# EAGLE design StoryBoxShield_v1 (EAGLE 5.11)
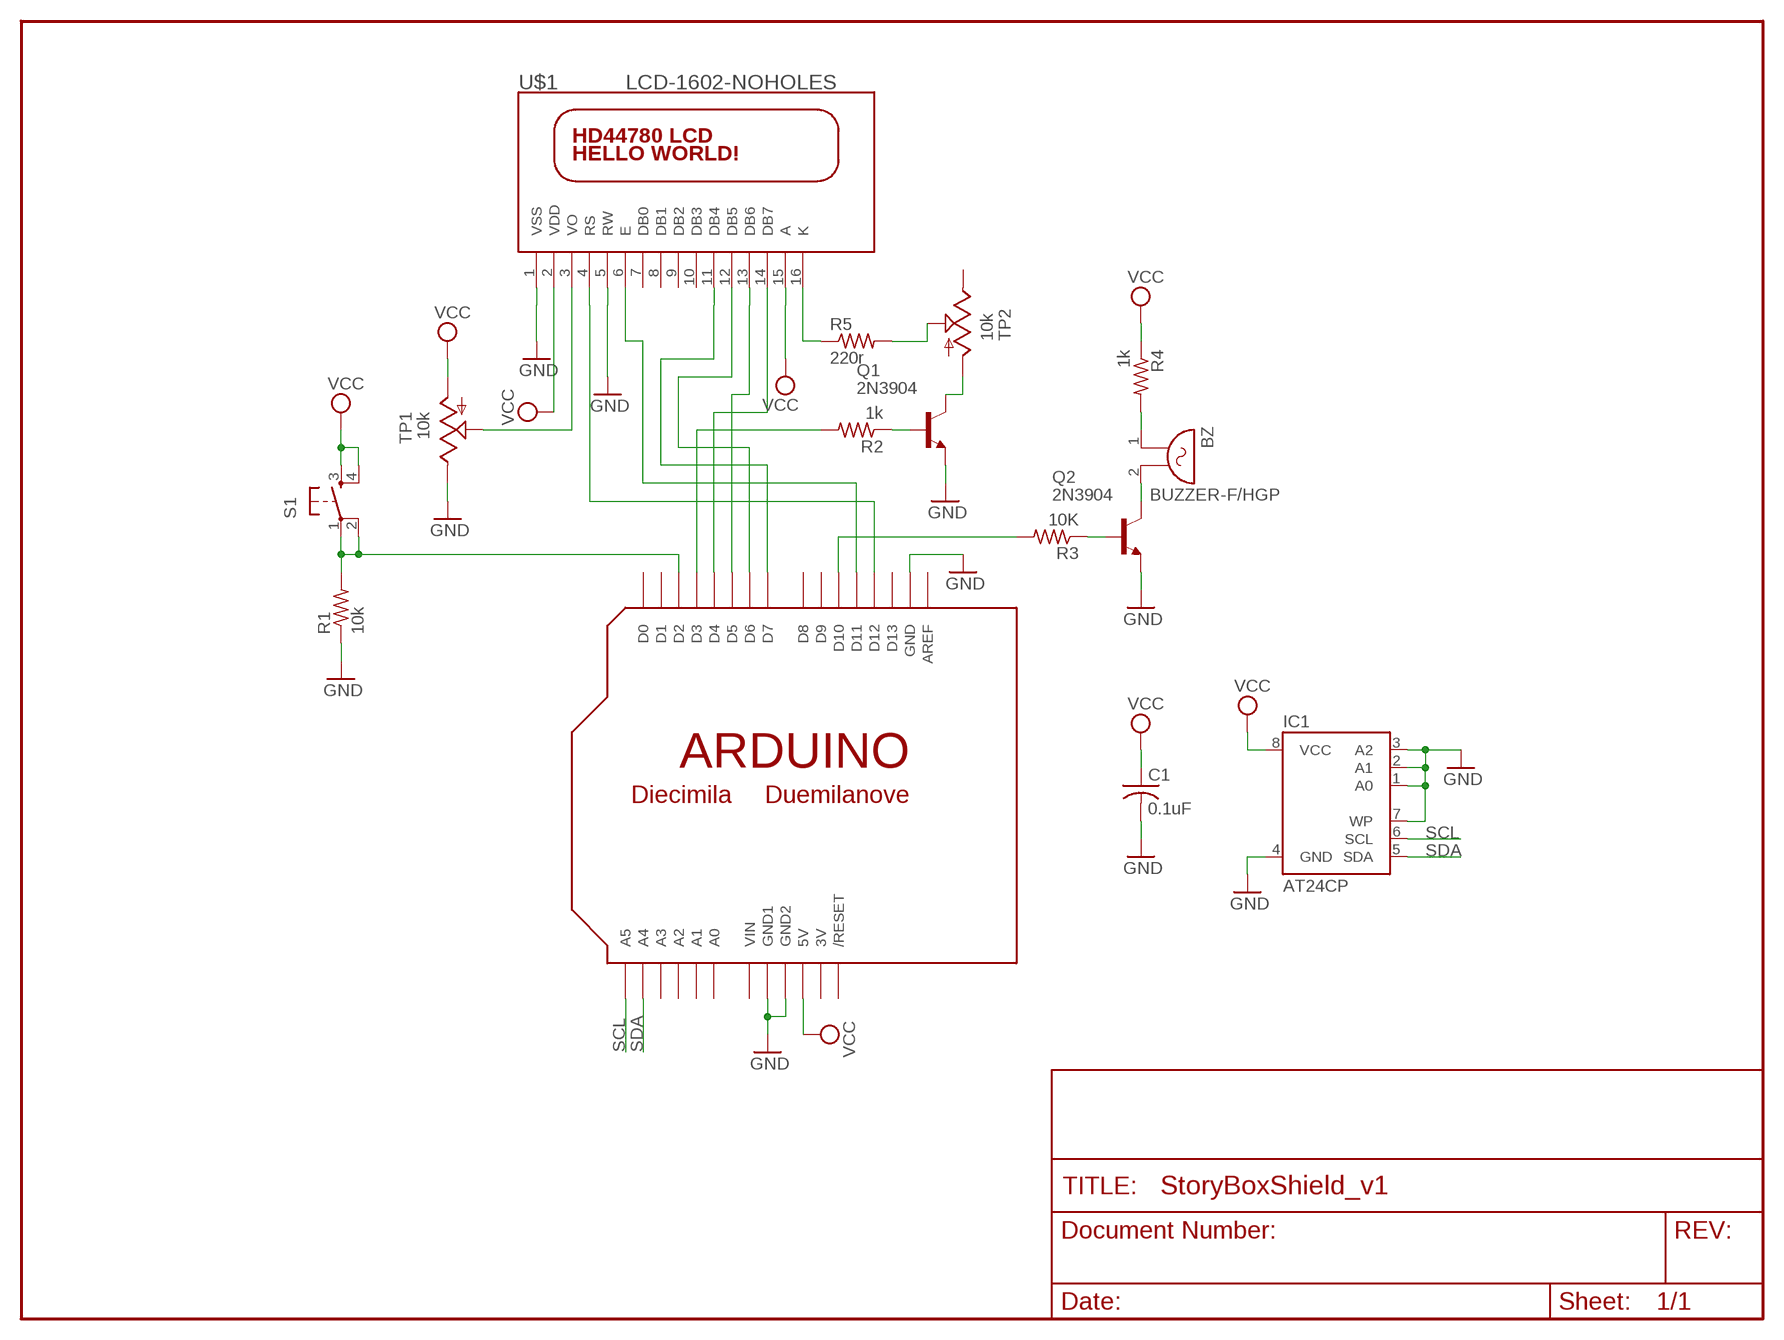
[diagram p0: schematic, sheet 1]

## Parts
BZ  BUZZER-F/HGP  [F/HGP]
C1  0.1uF  CAP-C050-025X075  [C050-025X075]
IC1  AT24CP  [DIL08]
Q1  2N3904  NPN-CBE-ZZ  [TO92-ZZ]
Q2  2N3904  NPN-CBE-ZZ  [TO92-ZZ]
R1  10k  RES0207/10-H  [0207/10-H]
R2  1k  RES0207/10-H  [0207/10-H]
R3  10K  RES0207/10-H  [0207/10-H]
R4  1k  RES0207/10-H  [0207/10-H]
R5  220r  RES0207/10-H  [0207/10-H]
S1  TAC_SWITCHPTH  [TACTILE-PTH]
TP1  10k  POT-TPOT-CB10V  [CB10V]
TP2  10k  POT-TPOT-CB10V  [CB10V]
U$1  LCD-1602-NOHOLES  [LCD1602-NOHOLES]
U$3  ARDUINO-DM-NOHOLE  [DM-NOHOLE]

## Nets
GND: C1.2 IC1.1(A0) IC1.2(A1) IC1.3(A2) IC1.4(GND) IC1.7(WP) Q1.3(E) Q2.3(E) R1.1 TP1.E2(E) U$1.1(VSS) U$1.5(RW) U$3.GND U$3.GND1 U$3.GND2
N$1: Q1.1(C) TP2.E1(A)
N$2: R5.1 U$1.16(K)
N$3: U$1.14(DB7) U$3.D4
N$4: U$1.13(DB6) U$3.D5
N$5: U$1.12(DB5) U$3.D6
N$6: U$1.11(DB4) U$3.D7
N$7: U$1.6(E) U$3.D11
N$8: U$1.4(RS) U$3.D12
N$9: TP1.V(S) U$1.3(VO)
N$10: R2.2 U$3.D3
N$11: R1.2 S1.1 S1.2 U$3.D2
N$12: R3.2 U$3.D10
N$13: BZ.2 Q2.1(C)
N$14: Q2.2(B) R3.1
N$17: BZ.1 R4.2
N$18: Q1.2(B) R2.1
N$19: R5.2 TP2.V(S)
SCL: IC1.6(SCL) U$3.A5
SDA: IC1.5(SDA) U$3.A4
VCC: C1.1 IC1.8(VCC) R4.1 S1.3 S1.4 TP1.E1(A) U$1.2(VDD) U$1.15(A) U$3.5V
Unconnected: TP2.E2(E) U$1.7(DB0) U$1.8(DB1) U$1.9(DB2) U$1.10(DB3) U$3.A0 U$3.A1 U$3.A2 U$3.A3 U$3.AREF U$3.D0 U$3.D1 U$3.D8 U$3.D9 U$3.D13 U$3.RESET(/RESET)

## Power pins joined to a net without a drawn wire
3V: U$3.3V
VIN: U$3.VIN

## Library data of the parts
BZ = fatpads:BUZZER
C1 = fatpads:CAP
IC1 = atmel:AT24C*: 2-wire serial EEPROM; MPN: AT24C1024BW-SH-B; OC_FARNELL: 1362646; OC_NEWARK: 03P2044
Q1 Q2 = fatpads:NPN
R1-R5 = fatpads:RES
S1 = SparkFun:TAC_SWITCH: Momentary Switch Button commonly used for reset or general input. Spark Fun Electronics SKU : COM-00097
TP1 TP2 = fatpads:POT
U$1 = fatpads:LCD
U$3 = fatpads:ARDUINO

## Net classes
0 default: width 1.27 mm, clearance 1.27 mm

## Board
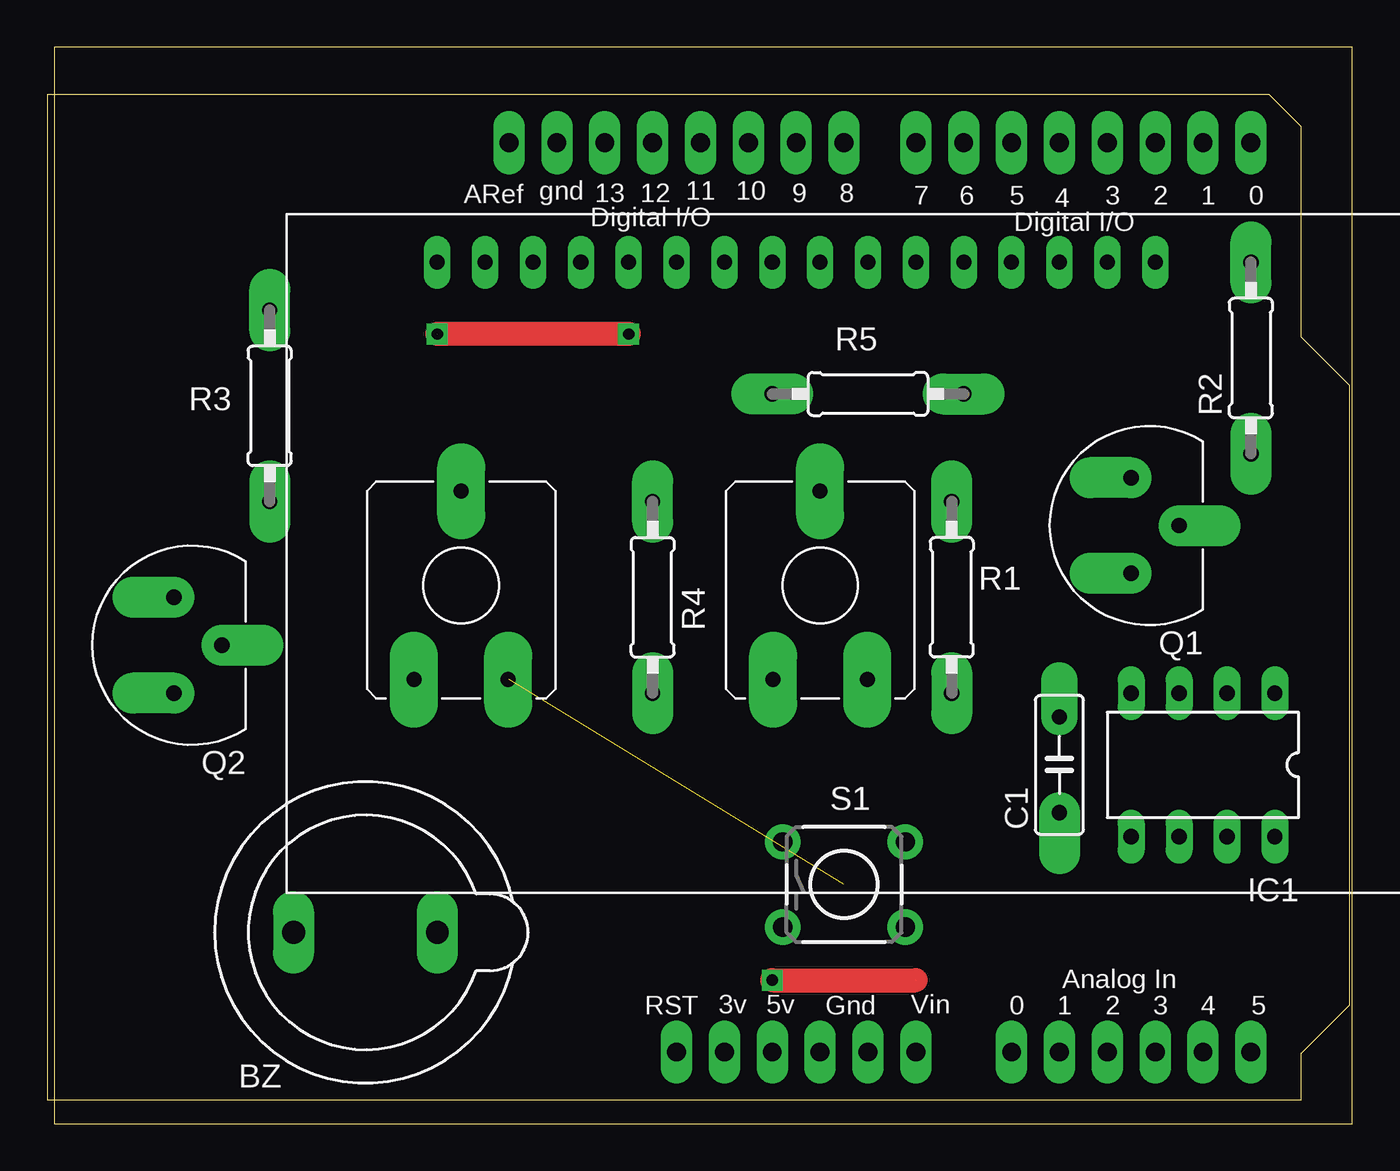
[diagram p1: board, top side]
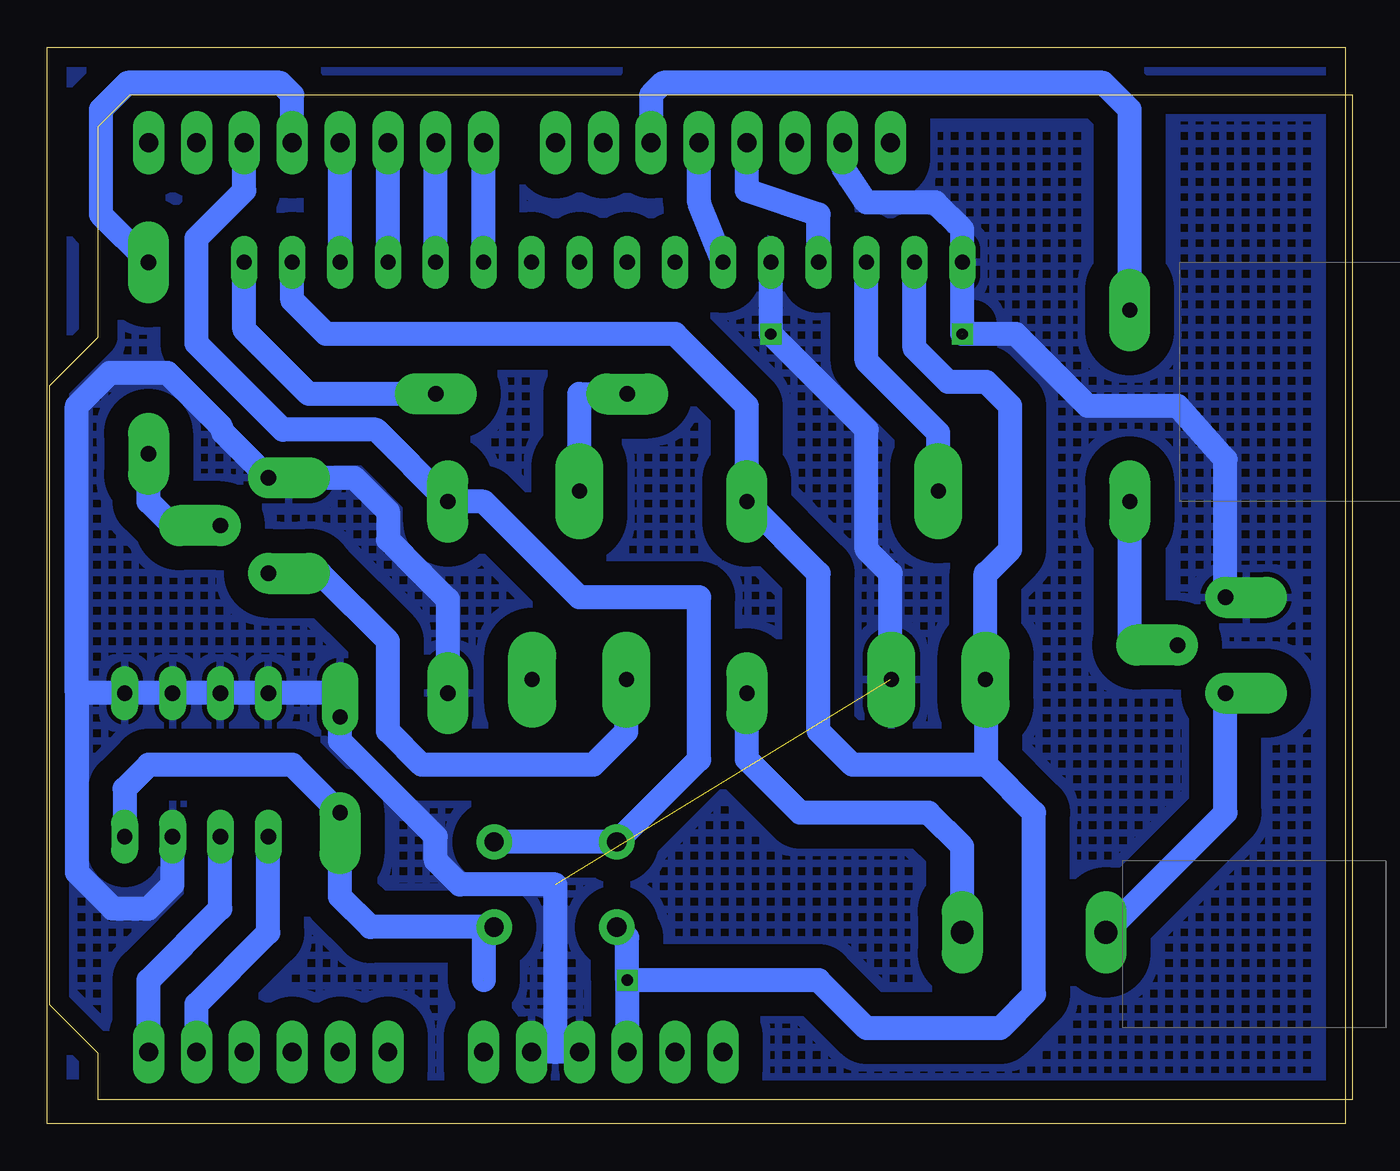
[diagram p2: board, bottom side, seen from below]

Size 68.89 x 57.14 mm. Coordinates in mm from the lower left corner, seen from the top.
Outline: 0,0 68.89,0 68.89,57.14 0,57.14 0,0
Copper layers (1*16): Top 0.035mm / dielectric 1.5mm / Bottom 0.035mm
Design rules "SparkFun *": minimum track width 50mil, minimum drill 20mil, track to track 8mil, track to pad 8mil, pad to pad 8mil, via to via 8mil, smd to smd 8mil, copper to edge 10mil, drill to drill 8mil, minimum pad ring 12mil, minimum via ring 10mil, stop-mask expansion 4mil, vias tented up to drill 25mil, thermal gap 10mil

### Footprints (pad centres in the part's own frame; a part is rotated, then mirrored left to right if it is on the bottom)
F/HGP = drill 1.2 pad 2.184 long: 1 -3.81,0; 2 3.81,0
C050-025X075 = drill 0.813 pad 2.184 offset: 1 -2.54,0 | drill 0.813 pad 1.93 offset: 2 2.54,0
DIL08 = drill 0.813 long: 1 -3.81,-3.81; 2 -1.27,-3.81; 3 1.27,-3.81; 4 3.81,-3.81; 5 3.81,3.81; 6 1.27,3.81; 7 -1.27,3.81; 8 -3.81,3.81
TO92-ZZ = drill 0.813 pad 2.184 offset: 1 -2.54,1.27; 2 0,-1.27; 3 2.54,1.27
0207/10-H = drill 0.813 pad 2.184 long: 1 -5.08,0; 2 5.08,0
TACTILE-PTH = drill 1.016 pad 1.88 round: 1 -3.251,2.261; 2 3.251,2.261; 3 -3.251,-2.261; 4 3.251,-2.261
CB10V = drill 0.8 pad 2.54 long: E1 -2.5,-5; E2 2.5,-5; V 0,5
LCD1602-NOHOLES = drill 0.8 long: 1 0,0; 2 2.54,0; 3 5.08,0; 4 7.62,0; 5 10.16,0; 6 12.7,0; 7 15.24,0; 8 17.78,0; 9 20.32,0; 10 22.86,0; 11 25.4,0; 12 27.94,0; 13 30.48,0; 14 33.02,0; 15 35.56,0; 16 38.1,0
DM-NOHOLE = drill 1 pad 1.676 long: 3V -27.94,-48.26; 5V -25.4,-48.26; A0 -12.7,-48.26; A1 -10.16,-48.26; A2 -7.62,-48.26; A3 -5.08,-48.26; A4 -2.54,-48.26; A5 0,-48.26; AREF -39.37,0; D0 0,0; D1 -2.54,0; D2 -5.08,0; D3 -7.62,0; D4 -10.16,0; D5 -12.7,0; D6 -15.24,0; D7 -17.78,0; D8 -21.59,0; D9 -24.13,0; D10 -26.67,0; D11 -29.21,0; D12 -31.75,0; D13 -34.29,0; GND -36.83,0; GND1 -20.32,-48.26; GND2 -22.86,-48.26; RESET -30.48,-48.26; VIN -17.78,-48.26

### Placement (x,y rotation side)
BZ  16.51,10.16 180 top
C1  53.34,19.05 90 top
IC1  60.96,19.05 180 top
Q1  58.42,31.75 90 top
Q2  7.62,25.4 90 top
R1  47.62,27.94 90 top
R2  63.5,40.64 90 top
R3  11.43,38.1 90 top
R4  31.75,27.94 270 top
R5  43.18,38.73 180 top
S1  41.91,12.7 0 top
TP1  21.59,28.57 0 top
TP2  40.64,28.57 0 top
U$1  20.32,45.72 0 top
U$3  63.5,52.07 0 top

### Tracks (layer width: path | path; a pad name or v marks a point on that pad's centre or on a via)
GND  (via drill 0.6)  (2 unrouted)
  Top 1.27: v30.48,41.91 20.32,41.91
  Bottom 1.27: U$3.GND 26.67,50.8 25.4,48.9 21.74,48.9 20.32,47.48 U$1.1 20.32,41.91 17.48,41.91 13.67,38.1 8.89,38.1 6.35,35.26 Q2.3 | U$3.GND2 41.91,3.81 | 41.91,3.81 U$3.GND1 | 67.31,22.86 67.31,38.1 65.54,39.87 62.51,39.87 59.69,37.05 59.54,36.68 Q1.3 52.6,34.29 50.8,32.49 50.8,31.01 49,29.21 47.62,27.83 R1.1 | 67.31,22.86 IC1.1 IC1.2 IC1.3 IC1.4 53.34,22.86 C1.2 53.34,20.32 48.26,15.24 48.26,13.97 46.99,12.7 41.91,12.7 41.91,3.81 | IC1.7 62.23,12.7 63.5,11.43 65.41,11.43 67.31,13.34 67.31,22.86 | TP1.E2 24.13,23.57 24.13,29.21 25.4,30.48 25.4,36.83 v30.48,41.91 U$1.5
  pour Bottom (isolate 1.016, hatched): 0,55.88 68.58,55.88 68.58,2.54 0,1.27
N$1
  Bottom 1.27: Q1.1 54.39,29.21 50.8,25.62 50.8,20.85 49,19.05 39.91,19.05 38.14,20.82 TP2.E1
N$2
  Bottom 1.27: R5.1 55,38.73 58.42,42.15 U$1.16
N$3
  Bottom 1.27: U$1.14 U$3.D4
N$4
  Bottom 1.27: U$1.13 U$3.D5
N$5
  Bottom 1.27: U$1.12 U$3.D6
N$6
  Bottom 1.27: U$1.11 U$3.D7
N$7
  Bottom 1.27: U$3.D11 34.29,48.9 U$1.6
N$8
  Bottom 1.27: U$1.4 27.94,48.26 31.75,49.53 U$3.D12
N$9
  Bottom 1.27: U$1.3 25.4,40.48 21.59,36.67 TP1.V
N$10
  Bottom 1.27: U$3.D3 55.88,54.61 56.52,55.24 64.62,55.24 66.04,53.83 66.04,48.26 R2.2
N$11
  Bottom 1.27: U$3.D2 58.42,49.53 60.96,46.99 60.96,41.41 56.38,36.83 51.44,36.83 R1.2 45.72,33.02 40.64,27.94 34.29,27.94 34.29,19.33 S1.1 S1.2
N$12
  Bottom 1.27: R3.2 11.43,53.34 11.43,53.83 12.85,55.24 36.2,55.24 36.83,54.61 U$3.D10
N$13
  Bottom 1.27: Q2.1 6.35,16.51 BZ.2
N$14
  Bottom 1.27: R3.1 11.43,25.4 Q2.2
N$15  (via drill 0.6)
  other vias: 20.32,41.91
N$17
  Bottom 1.27: R4.2 31.75,19.35 28.91,16.51 22.12,16.51 20.32,14.71 BZ.1
N$18
  Bottom 1.27: Q1.2 62.23,31.75 63.5,33.02 R2.1
N$19
  Bottom 1.27: R5.2 40.64,38.73 TP2.V
SCL
  Bottom 1.27: IC1.6 59.69,11.43 63.5,7.62 U$3.A5
SDA
  Bottom 1.27: U$3.A4 60.96,6.35 57.15,10.16 IC1.5
VCC  (via drill 0.6)  (1 unrouted)
  Top 1.27: v38.1,7.62 45.72,7.62
  Bottom 1.27: U$1.15 55.88,43.71 54.08,41.91 35.56,41.91 31.75,38.1 R4.1 27.94,29.21 27.94,20.85 26.14,19.05 19.05,19.05 | IC1.8 64.77,17.78 63.5,19.05 55.88,19.05 C1.1 53.34,12.05 51.73,10.44 S1.4 45.72,10.44 45.72,7.62 | 19.05,19.05 19.05,23.57 TP1.E1 19.09,29.21 19.05,29.21 17.78,30.48 17.78,38.1 19.05,39.37 21.06,39.37 22.86,41.17 U$1.2 | v38.1,7.62 U$3.5V | S1.3 38.1,9.88 v38.1,7.62 | v38.1,7.62 27.94,7.62 25.4,5.08 18.31,5.08 16.51,6.88 16.51,16.51 19.05,19.05

### Text on the board
tDocu: The Story Box - v1 | Hackerspace KL